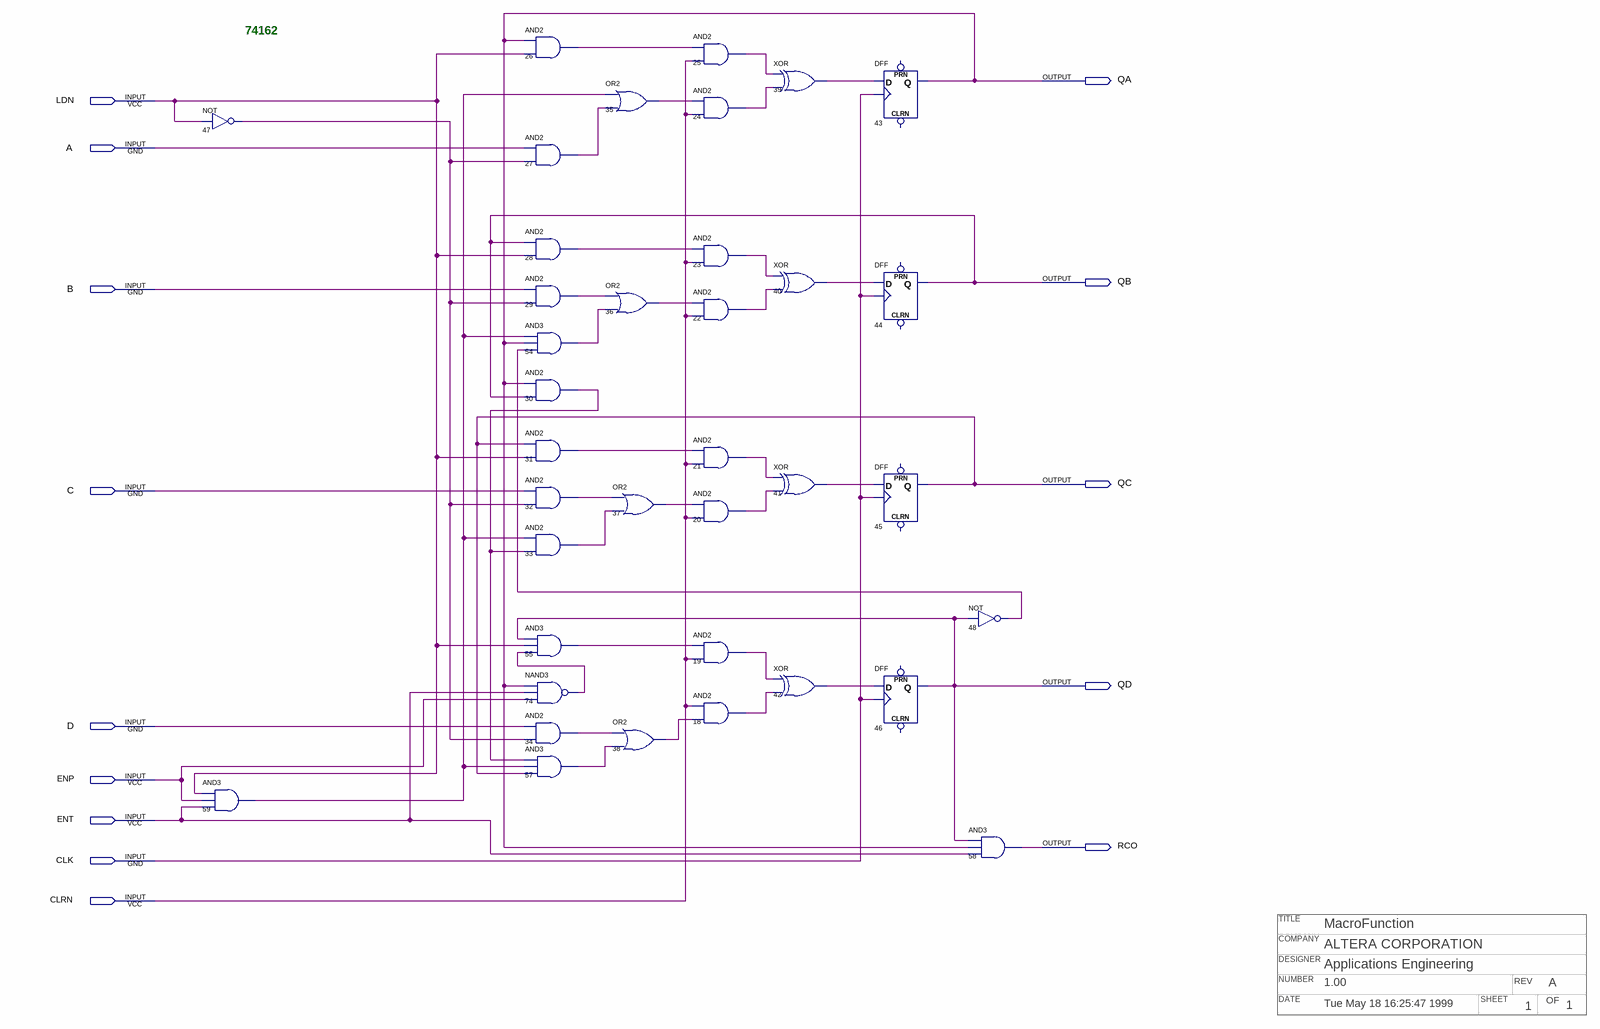
[diagram p0: schematic sheet]
// Quartus schematic 74162.bdf as structural Verilog: 37 symbols, 14 pins
// Title block: TITLE: MacroFunction; COMPANY: ALTERA CORPORATION; DESIGNER: Applications Engineering; NUMBER: 1.00; REV: A; DATE: Tue May 18 16:25:47 1999; SHEET: 1; OF: 1
module \74162  (
  input  LDN,
  input  A,
  input  B,
  input  C,
  input  D,
  input  ENP,
  input  ENT,
  input  CLK,
  input  CLRN,
  output QA,
  output QB,
  output QC,
  output QD,
  output RCO
);

  wire n18_out, n19_out, n20_out, n21_out, n22_out, n23_out, n24_out, n25_out, n26_out, n27_out, n28_out,
       n29_out, n30_out, n31_out, n32_out, n33_out, n34_out, n35_out, n36_out, n37_out, n38_out, n39_out,
       n40_out, n41_out, n42_out, n47_out, n48_out, n54_out, n55_out, n57_out, n59_out, n74_out;

  not u_47 (n47_out, LDN);
  and u_59 (n59_out, LDN, ENP, ENT);
  and u_26 (n26_out, QA, LDN);
  and u_27 (n27_out, A, n47_out);
  and u_28 (n28_out, QB, LDN);
  and u_29 (n29_out, B, n47_out);
  and u_54 (n54_out, n59_out, QA, n48_out);
  and u_30 (n30_out, QA, QB);
  and u_31 (n31_out, QC, LDN);
  and u_32 (n32_out, C, n47_out);
  and u_33 (n33_out, n59_out, n30_out);
  and u_55 (n55_out, QD, LDN, n74_out);
  nand u_74 (n74_out, QA, ENT, ENP);
  and u_34 (n34_out, D, n47_out);
  and u_57 (n57_out, n30_out, n59_out, QC);
  or u_35 (n35_out, n59_out, n27_out);
  or u_36 (n36_out, n29_out, n54_out);
  or u_37 (n37_out, n32_out, n33_out);
  or u_38 (n38_out, n34_out, n57_out);
  and u_25 (n25_out, n26_out, CLRN);
  and u_24 (n24_out, n35_out, CLRN);
  and u_23 (n23_out, n28_out, CLRN);
  and u_22 (n22_out, n36_out, CLRN);
  and u_21 (n21_out, n31_out, CLRN);
  and u_20 (n20_out, n37_out, CLRN);
  and u_19 (n19_out, n55_out, CLRN);
  and u_18 (n18_out, CLRN, n38_out);
  xor u_39 (n39_out, n25_out, n24_out);
  xor u_40 (n40_out, n23_out, n22_out);
  xor u_41 (n41_out, n21_out, n20_out);
  xor u_42 (n42_out, n19_out, n18_out);
  DFF u_43 (.CLK(CLK), .D(n39_out), .Q(QA));  // open: CLRN, PRN
  DFF u_44 (.CLK(CLK), .D(n40_out), .Q(QB));  // open: CLRN, PRN
  DFF u_45 (.CLK(CLK), .D(n41_out), .Q(QC));  // open: CLRN, PRN
  DFF u_46 (.CLK(CLK), .D(n42_out), .Q(QD));  // open: CLRN, PRN
  not u_48 (n48_out, QD);
  and u_58 (RCO, QD, QA, ENT);

  // Notes on the sheet:
  //   74162
endmodule
